# EAGLE design Application Board (EAGLE 8.2.2)
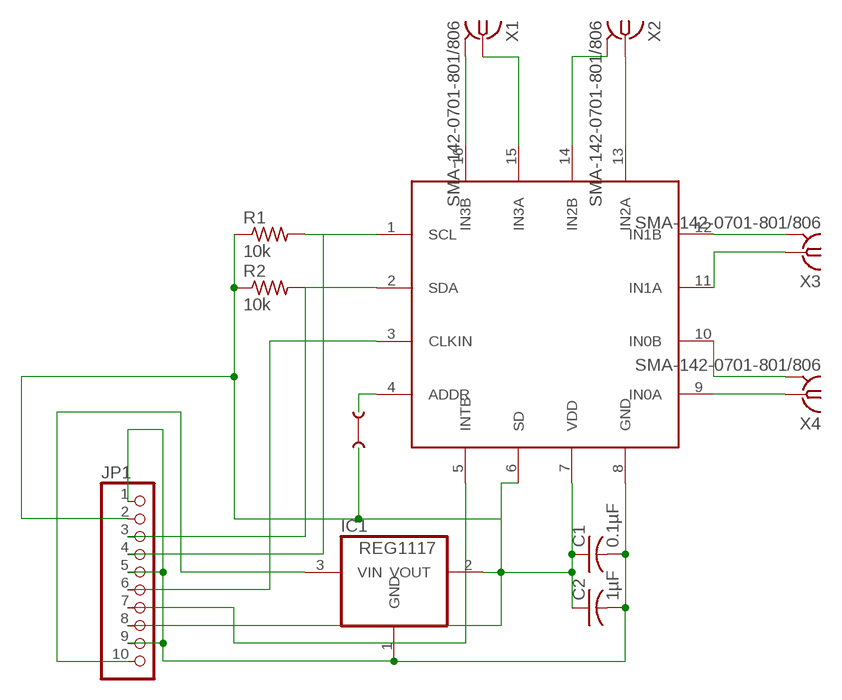
[diagram p0: schematic, sheet 1]

## Parts
C1  0.1µF  C-USC0402  [C0402]
C2  1µF  C-USC0402  [C0402]
IC1  REG1117  [SOT223]
J1  JUMP-Q  [JUMP]
JP1  PINHD-1X10  [1X10]
R1  10k  R-US_M0805  [M0805]
R2  10k  R-US_M0805  [M0805]
U$1  FDC2214  [QFN16-4X4]
X1  SMA-142-0701-801/806  [J502-ND-142-0701-801/806]
X2  SMA-142-0701-801/806  [J502-ND-142-0701-801/806]
X3  SMA-142-0701-801/806  [J502-ND-142-0701-801/806]
X4  SMA-142-0701-801/806  [J502-ND-142-0701-801/806]

## Nets
N$1: JP1.6 U$1.3(CLKIN)
N$2: C1.2 C2.2 IC1.1(GND) JP1.1 JP1.5 JP1.9 U$1.8(GND)
N$3: C1.1 C2.1 IC1.2(VOUT) JP1.2 R1.1 R2.1 U$1.7(VDD)
N$4: JP1.3 R2.2 U$1.2(SDA)
N$5: JP1.4 R1.2 U$1.1(SCL)
N$6: U$1.16(IN3B) X1.G@1 X1.G@2 X1.G@3 X1.G@4
N$7: U$1.15(IN3A) X1.1
N$8: U$1.14(IN2B) X2.G@1 X2.G@2 X2.G@3 X2.G@4
N$9: U$1.13(IN2A) X2.1
N$10: U$1.12(IN1B) X3.G@1 X3.G@2 X3.G@3 X3.G@4
N$11: U$1.11(IN1A) X3.1
N$12: U$1.10(IN0B) X4.G@1 X4.G@2 X4.G@3 X4.G@4
N$13: U$1.9(IN0A) X4.1
N$14: U$1.4(ADDR)
N$15: IC1.3(VIN) JP1.10
N$16: JP1.7 U$1.5(INTB)
N$17: JP1.8 U$1.6(SD)

## Library data of the parts
C1 C2 = rcl:C-US: CAPACITOR, American symbol
IC1 = burr-brown:REG1117: 800mA and 1A Low Dropout (LDO) Positive Regulator 1.8V, 2.5V, 2.85V, 3.3V, 5V, and Adj; MPN: REG1117; OC_FARNELL: 1097566; OC_NEWARK: 14P6981
J1 = jumper:JUMP-Q: JUMPER header
JP1 = pinhead:PINHD-1X10: PIN HEADER
R1 R2 = resistor:R-US_: RESISTOR, American symbol
U$1 = FDC2214:FDC2214
X1-X4 = con-coax:SMA-: SMA 50 Ohm End Launch Jack Receptacle - Round Contact Johnson Components Source: www.johnsoncomponents.com .. J502-ND.pdf; MF: JOHNSON COMPONENTS; MPN: 142-0701-801; OC_FARNELL: 1608592; OC_NEWARK: 90F2624

## Board
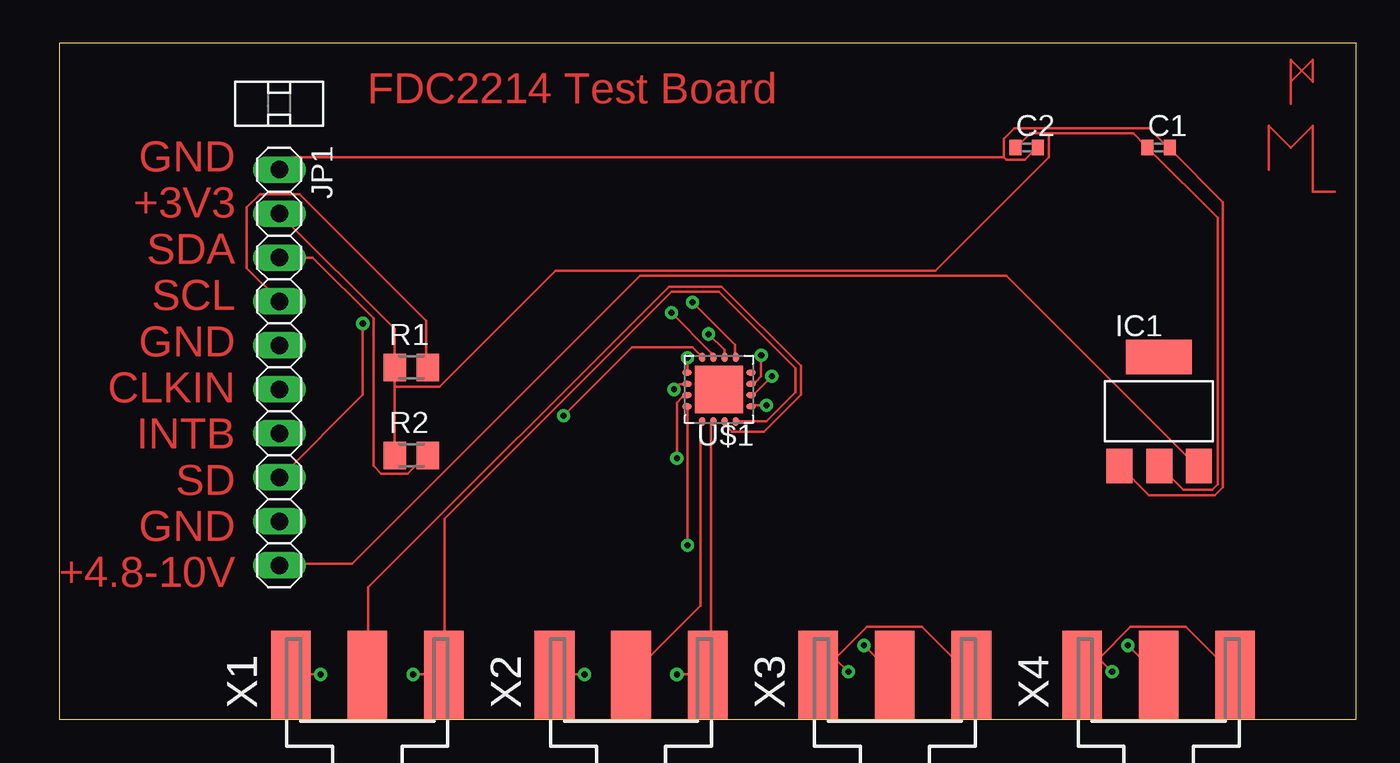
[diagram p1: board, top side]
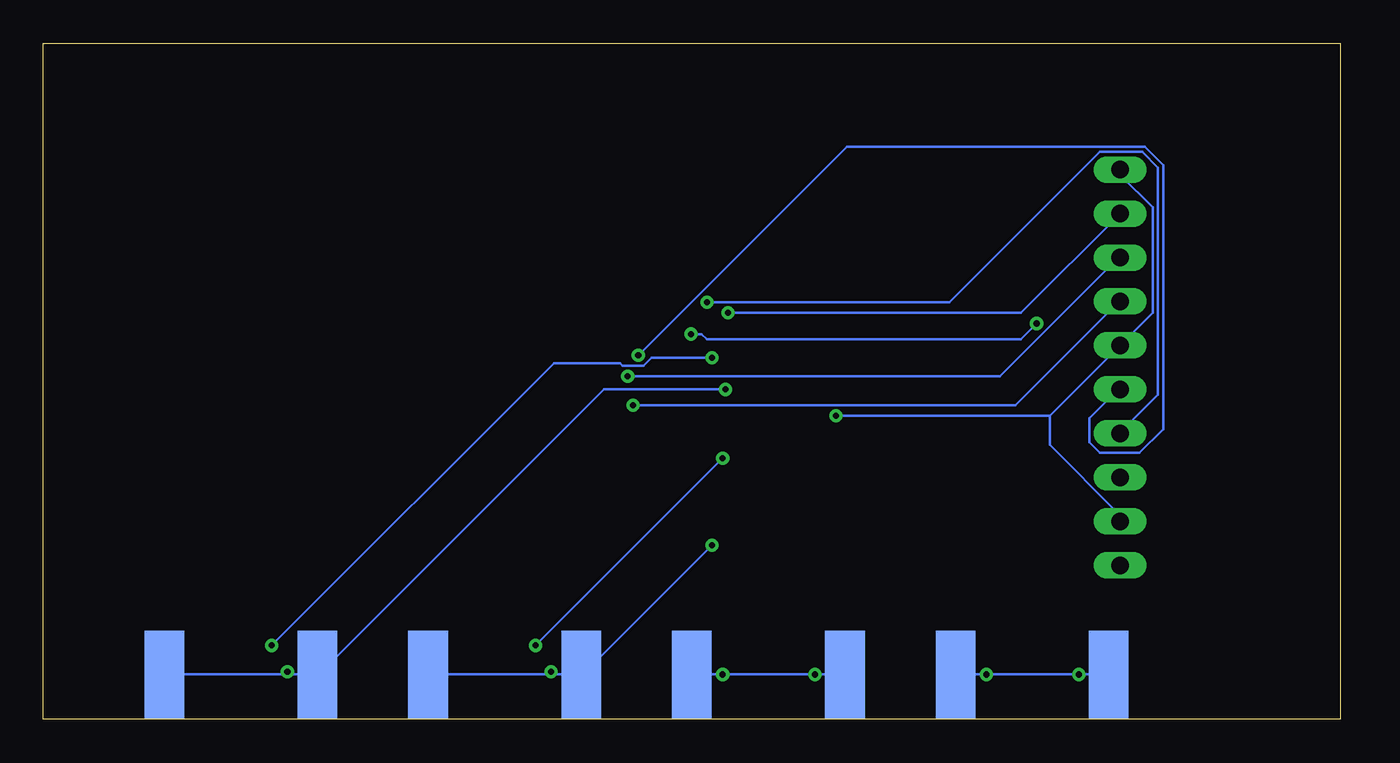
[diagram p2: board, bottom side, seen from below]

Size 74.91 x 39.04 mm. Coordinates in mm from the lower left corner, seen from the top.
Outline: 0,0 74.91,0 74.91,39.04 0,39.04 0,0
Copper layers (1*16): Top 0.035mm / dielectric 1.5mm / Bottom 0.035mm
Design rules "default": minimum track width 6mil, minimum drill 0.35mm, track to track 6mil, track to pad 6mil, pad to pad 6mil, via to via 6mil, smd to smd 6mil, copper to edge 40mil, drill to drill 6mil, minimum pad ring 10mil, minimum via ring 8mil, stop-mask expansion 4mil, vias tented up to drill 0mil, thermal gap 10mil

### Footprints (pad centres in the part's own frame; a part is rotated, then mirrored left to right if it is on the bottom)
C0402 = smd 0.7 x 0.9: 1 -0.65,0; 2 0.65,0
SOT223 = smd 1.499 x 2.007: 1 -2.261,-3.15; 2 0.025,-3.15; 3 2.311,-3.15 | smd 3.81 x 2.007: 4 0,3.15
1X10 = drill 1.016 long: 1 -11.43,0; 2 -8.89,0; 3 -6.35,0; 4 -3.81,0; 5 -1.27,0; 6 1.27,0; 7 3.81,0; 8 6.35,0; 9 8.89,0; 10 11.43,0
M0805 = smd 1.3 x 1.6: 1 -0.95,0; 2 0.95,0
QFN16-4X4 = smd 0.55 x 0.35: 1 -1.85,0.975; 2 -1.85,0.325; 3 -1.85,-0.325; 4 -1.85,-0.975; 9 1.85,-0.975; 10 1.85,-0.325; 11 1.85,0.325; 12 1.85,0.975 | smd 0.35 x 0.55: 5 -0.975,-1.85; 6 -0.325,-1.85; 7 0.325,-1.85; 8 0.975,-1.85; 13 0.975,1.85; 14 0.325,1.85; 15 -0.325,1.85; 16 -0.975,1.85 | smd 2.76 x 2.76: EXP 0,0
J502-ND-142-0701-801/806 = smd 5.08 x 2.286: 1 2.565,0; G@1 2.565,4.42; G@2 2.565,-4.42 | smd 5.08 x 2.286 bottom: G@3 2.565,4.42; G@4 2.565,-4.42

### Placement (x,y rotation side)
C1  63.5,33.02 0 top
C2  55.88,33.02 0 top
IC1  63.5,17.78 0 top
J1  12.7,35.56 90 top
JP1  12.7,20.32 270 top
R1  20.32,20.32 0 top
R2  20.32,15.24 0 top
U$1  38.1,19.05 180 top
X1  17.78,0 90 top
X2  33.02,0 90 top
X3  48.26,0 90 top
X4  63.5,0 90 top

### Tracks (layer width: path | path; a pad name or v marks a point on that pad's centre or on a via)
N$1  (via drill 0.35)
  Top 0.152: v40.54,21.03 40.54,19.81 40.23,19.51 40.08,19.51 U$1.3
  Bottom 0.152: v40.54,21.03 28.5,33.07 11.28,33.07 10.21,32 10.21,16.76 11.58,15.39 13.87,15.39 14.48,16 14.48,17.37 12.8,19.05 JP1.6
N$2  (via drill 0.35)
  Top 0.152: 54.56,32.46 54.71,32.31 55.78,32.31 56.39,32.92 C2.2 | 54.56,32.46 54.56,33.53 55.17,34.14 62.94,34.14 64.01,33.07 C1.2 64.16,32.92 67.21,29.87 67.21,13.41 66.75,12.95 62.94,12.95 61.27,14.63 IC1.1 | v29.11,17.53 33.07,21.49 36.58,21.49 37.03,21.03 U$1.8 | 54.56,32.46 13.41,32.46 JP1.1
  Bottom 0.152: 16.76,17.53 v29.11,17.53 | 16.76,17.53 JP1.5 10.82,23.47 10.82,29.57 12.65,31.39 12.65,31.7 JP1.1 | 16.76,17.53 16.76,15.85 12.8,11.89 12.8,11.43 JP1.9
N$3  (via drill 0.35)
  Top 0.152: 57.15,33.83 62.03,33.83 62.79,33.07 C1.1 62.94,32.92 66.9,28.96 66.9,13.56 66.6,13.26 64.92,13.26 63.55,14.63 IC1.2 | 57.15,33.83 56.08,33.83 55.32,33.07 C2.1 | 19.36,19.2 19.36,20.27 R1.1 19.36,20.42 19.36,22.55 JP1.2 | 19.36,19.2 19.36,15.24 R2.1 | v35.36,23.47 37.64,21.18 37.64,21.03 U$1.7 | 57.15,33.83 57.15,32.46 50.6,25.91 28.65,25.91 21.95,19.2 19.36,19.2
  Bottom 0.152: v35.36,23.47 18.44,23.47 JP1.2
N$4  (via drill 0.35)
  Top 0.152: v41.15,19.81 40.08,18.75 U$1.2 | JP1.3 14.63,26.67 18.14,23.16 18.14,14.63 18.59,14.17 20.12,14.17 21.18,15.24 R2.2
  Bottom 0.152: v41.15,19.81 19.66,19.81 12.8,26.67 JP1.3
N$5  (via drill 0.35)
  Top 0.152: v40.84,18.14 40.08,18.14 U$1.1 | R1.2 21.18,20.42 21.18,23.01 13.87,30.33 11.58,30.33 10.82,29.57 10.82,26.06 12.65,24.23 JP1.4
  Bottom 0.152: v40.84,18.14 18.75,18.14 12.8,24.08 JP1.4
N$6  (via drill 0.35)
  Top 0.152: v15.09,2.59 13.41,2.59 X1.G@3 | U$1.16 39.17,17.22 40.84,17.22 42.52,18.9 42.52,20.27 38.1,24.69 35.36,24.69 22.25,11.58 22.25,2.59 X1.G@4 22.1,2.59 v20.42,2.59
  Bottom 0.152: X1.G@3 13.41,2.59 v15.09,2.59 v20.42,2.59 22.1,2.59 X1.G@4
N$7
  Top 0.152: U$1.15 38.56,17.07 38.56,16.92 38.86,16.61 40.69,16.61 42.82,18.75 42.82,20.42 38.25,24.99 35.2,24.99 17.83,7.62 17.83,2.59 X1.1
N$8  (via drill 0.35)
  Top 0.152: v30.33,2.59 28.65,2.59 X2.G@3 | U$1.14 37.64,17.07 37.64,2.74 37.49,2.59 X2.G@4 37.34,2.59 v35.66,2.59
  Bottom 0.152: X2.G@3 28.65,2.59 v30.33,2.59 v35.66,2.59 37.34,2.59 X2.G@4
N$9
  Top 0.152: U$1.13 37.03,17.07 37.03,6.55 33.07,2.59 X2.1
N$10  (via drill 0.35)
  Top 0.152: 44.81,3.5 46.63,5.33 49.84,5.33 52.58,2.59 X3.G@4 | 44.81,3.5 43.89,2.59 X3.G@3 44.81,3.5 | v36.27,10.06 36.27,17.98 U$1.12 | v45.57,2.74 44.81,3.5
  Bottom 0.152: v36.27,10.06 43.74,2.59 X3.G@3 43.89,2.59 45.57,2.59 | 45.57,2.59 52.58,2.59 X3.G@4 | 45.57,2.59 v45.57,2.74
N$11  (via drill 0.35)
  Top 0.152: v35.66,15.09 35.66,18.29 35.97,18.59 36.12,18.59 U$1.11 | v46.48,4.27 48.16,2.59 X3.1
  Bottom 0.152: v46.48,4.27 v35.66,15.09
N$12  (via drill 0.35)
  Top 0.152: 60.05,3.5 61.87,5.33 65.08,5.33 67.82,2.59 X4.G@4 | 60.05,3.5 59.13,2.59 X4.G@3 60.05,3.5 | v35.51,19.05 35.81,19.36 36.12,19.36 U$1.10 | v60.81,2.74 60.05,3.5
  Bottom 0.152: v35.51,19.05 42.52,19.05 58.98,2.59 X4.G@3 59.13,2.59 60.81,2.59 | 60.81,2.59 67.82,2.59 X4.G@4 | 60.81,2.59 v60.81,2.74
N$13  (via drill 0.35)
  Top 0.152: v36.27,20.88 36.27,20.12 U$1.9 | v61.72,4.27 63.4,2.59 X4.1
  Bottom 0.152: v36.27,20.88 39.78,20.88 40.23,20.42 41.45,20.42 41.6,20.57 45.41,20.57 v61.72,4.27
N$15
  Top 0.152: IC1.3 65.68,14.63 54.71,25.6 33.53,25.6 16.92,8.99 12.8,8.99 JP1.10
N$16  (via drill 0.35)
  Top 0.152: v36.58,24.08 39.01,21.64 39.01,21.03 U$1.5
  Bottom 0.152: v36.58,24.08 22.55,24.08 13.87,32.77 11.43,32.77 10.52,31.85 10.52,18.75 12.65,16.61 JP1.7
N$17  (via drill 0.35)
  Top 0.152: v37.49,22.25 38.41,21.34 38.41,21.03 U$1.6 | v17.53,22.86 17.53,18.75 12.8,14.02 JP1.8
  Bottom 0.152: v37.49,22.25 36.88,22.25 36.58,21.95 18.44,21.95 v17.53,22.86
N$18
  Top 0.152: 71.12,35.56 71.12,36.83 | 71.12,36.83 71.12,38.1 72.39,36.83 72.39,38.1 71.12,36.83
N$19
  Top 0.152: 69.85,31.75 69.85,34.29 71.12,33.02 72.39,34.29 72.39,30.48 73.66,30.48

### Text on the board
Top: FDC2214 Test Board | GND / +3V3 / SDA / SCL / GND / CLKIN / INTB / SD / GND / +4.8-10V